# EAGLE design reader (EAGLE 6.4)
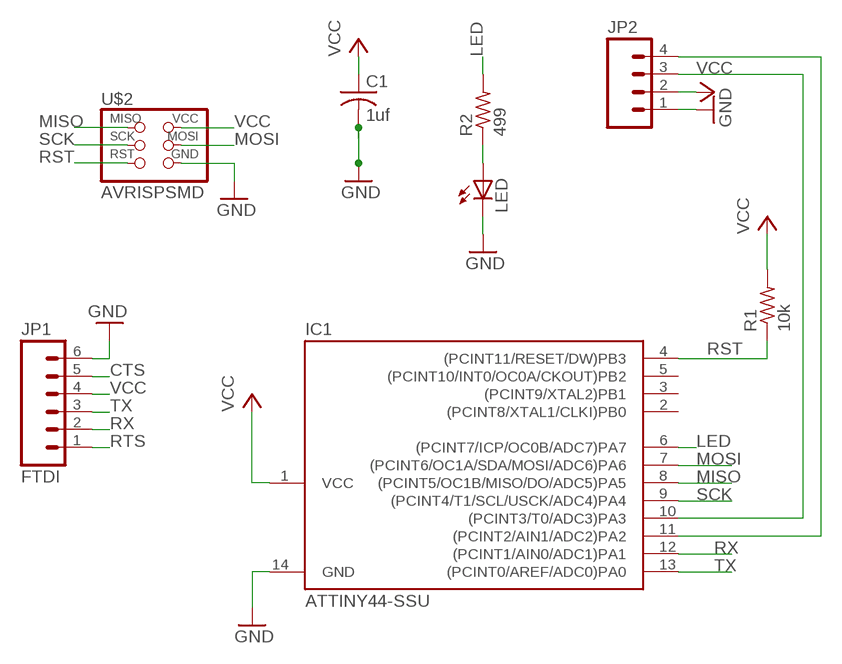
[diagram p0: schematic, sheet 1]

## Parts
C1  1uf  C-USC1206  [C1206]
IC1  ATTINY44-SSU  [SOIC14]
JP1  FTDI  M06SMD  [1X06-SMD]
JP2  M04LONGPADS  [1X04_LONGPADS]
LED  LEDSMT1206  [1206]
R1  10k  R-US_R1206  [R1206]
R2  499  R-US_R1206  [R1206]
U$2  AVRISPSMD  [2X03SMD]

## Nets
CTS: JP1.5
GND: C1.2 IC1.14(GND) JP1.6 JP2.1 LED.C U$2.6(GND)
LED: IC1.6((PCINT7/ICP/OC0B/ADC7)PA7) R2.2
MISO: IC1.8((PCINT5/OC1B/MISO/DO/ADC5)PA5) U$2.1(MISO)
MOSI: IC1.7((PCINT6/OC1A/SDA/MOSI/ADC6)PA6) U$2.4(MOSI)
N$1: IC1.10((PCINT3/T0/ADC3)PA3) JP2.3
N$2: IC1.11((PCINT2/AIN1/ADC2)PA2) JP2.4
N$4: LED.A R2.1
RST: IC1.4((PCINT11/RESET/DW)PB3) R1.1 U$2.5(RST)
RTS: JP1.1
RX: IC1.12((PCINT1/AIN0/ADC1)PA1) JP1.2
SCK: IC1.9((PCINT4/T1/SCL/USCK/ADC4)PA4) U$2.3(SCK)
TX: IC1.13((PCINT0/AREF/ADC0)PA0) JP1.3
VCC: C1.1 IC1.1(VCC) JP1.4 JP2.2 R1.2 U$2.2(VCC)
Unconnected: IC1.2((PCINT8/XTAL1/CLKI)PB0) IC1.3((PCINT9/XTAL2)PB1) IC1.5((PCINT10/INT0/OC0A/CKOUT)PB2)

## Library data of the parts
C1 = rcl:C-US: CAPACITOR, American symbol
IC1 = fab:ATTINY44
JP1 = SparkFun:M06: Header 6 Standard 6-pin 0.1" header. Use with straight break away headers (SKU : PRT-00116), right angle break away headers (PRT-00553), swiss pins (PRT-00743), machine pins (PRT-00117), and female headers (PRT-00115). Molex polarized connector foot print use with SKU : PRT-08094 with associated crimp pins and housings. NOTES ON THE VARIANTS LOCK and LOCK_LONGPADS... This footprint was designed to help hold the alignment of a through-hole component (i.e. 6-pin header) while soldering it into place. You may notice that each hole has been shifted either up or down by 0.005 of an inch from it's more standard position (which is a perfectly straight line). This slight alteration caused the pins (the squares in the middle) to touch the edges of the holes. Because they are alternating, it causes a "brace" to hold the component in place. 0.005 has proven to be the perfect amount of "off-center" position when using our standard breakaway headers. Although looks a little odd when you look at the bare footprint, once you have a header in there, the alteration is very hard to notice. Also, if you push a header all the way into place, it is covered up entirely on the bottom side. This idea of altering the position of holes to aid alignment will be further integrated into the Sparkfun Library for other footprints. It can help hold any component with 3 or more connection pins.
JP2 = 01_SparkFun:M04: Header 4 Standard 4-pin 0.1" header. Use with straight break away headers (SKU : PRT-00116), right angle break away headers (PRT-00553), swiss pins (PRT-00743), machine pins (PRT-00117), and female headers (PRT-00115). Molex polarized connector foot print use with SKU : PRT-08231 with associated crimp pins and housings.
LED = 01_adafruit:LED: LED OSRAM: - CHIPLED LG R971, LG N971, LY N971, LG Q971, LY Q971, LO R971, LY R971 LH N974, LH R974 LS Q976, LO Q976, LY Q976 LO Q996 - Hyper CHIPLED LW Q18S LB Q993, LB Q99A, LB R99A - SideLED LS A670, LO A670, LY A670, LG A670, LP A670 LB A673, LV A673, LT A673, LW A673 LH A674 LY A675 LS A676, LA A676, LO A676, LY A676, LW A676 LS A679, LY A679, LG A679 - Hyper Micro SIDELED® LS Y876, LA Y876, LO Y876, LY Y876 LT Y87S - SmartLED LW L88C, LW L88S LB L89C, LB L89S, LG L890 LS L89K, LO L89K, LY L89K LS L896, LA L896, LO L896, LY L896 - TOPLED LS T670, LO T670, LY T670, LG T670, LP T670 LSG T670, LSP T670, LSY T670, LOP T670, LYG T670 LG T671, LOG T671, LSG T671 LB T673, LV T673, LT T673, LW T673 LH T674 LS T676, LA T676, LO T676, LY T676, LB T676, LH T676, LSB T676, LW T676 LB T67C, LV T67C, LT T67C, LS T67K, LO T67K, LY T67K, LW E67C LS E67B, LA E67B, LO E67B, LY E67B, LB E67C, LV E67C, LT E67C LW T67C LS T679, LY T679, LG T679 LS T770, LO T770, LY T770, LG T770, LP T770 LB T773, LV T773, LT T773, LW T773 LH T774 LS E675, LA E675, LY E675, LS T675 LS T776, LA T776, LO T776, LY T776, LB T776 LHGB T686 LT T68C, LB T68C - Hyper Mini TOPLED® LB M676 - Mini TOPLED Santana® LG M470 LS M47K, LO M47K, LY M47K Source: http://www.osram.convergy.de/
R1 R2 = resistor:R-US_: RESISTOR, American symbol
U$2 = fab:AVRISP

## Board
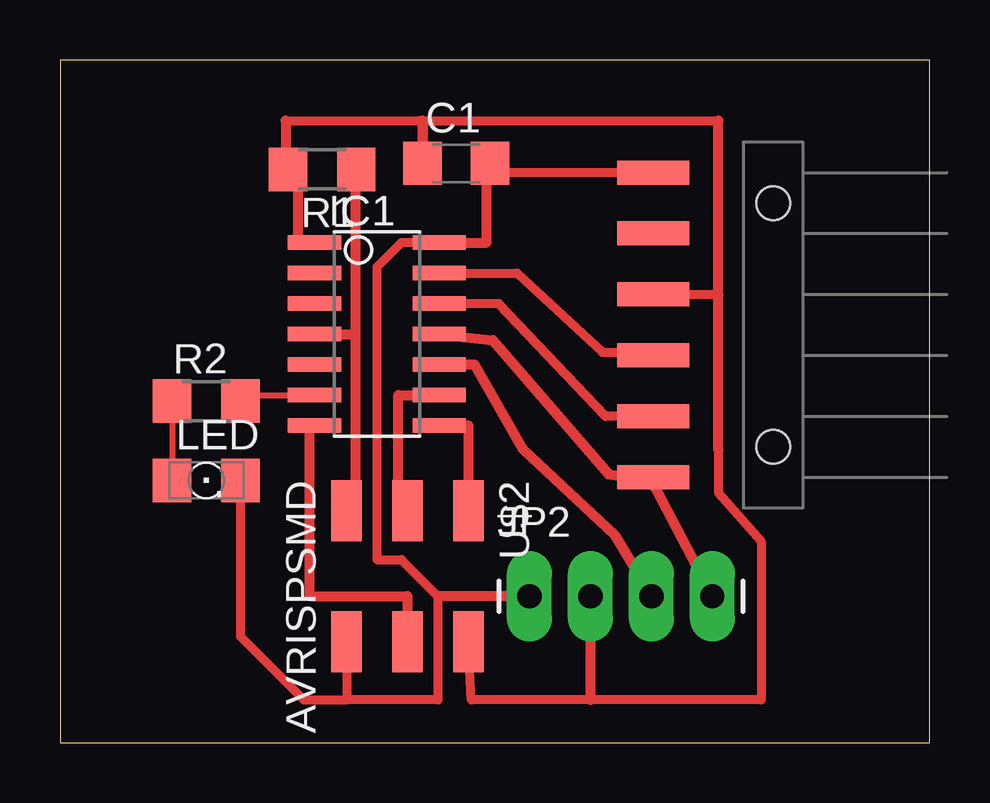
[diagram p1: board, top side]

Size 36.25 x 28.44 mm. Coordinates in mm from the lower left corner, seen from the top.
Outline: 0,0 36.25,0 36.25,28.44 0,28.44 0,0
Copper layers 1: Top 0.035mm
Design rules "ERP-1sided-10mil-16mill": minimum track width 10mil, minimum drill 24mil, track to track 16mil, track to pad 16mil, pad to pad 16mil, via to via 16mil, smd to smd 0mil, copper to edge 16mil, drill to drill 36mil, minimum pad ring 10mil, minimum via ring 8mil, stop-mask expansion 4mil, vias tented up to drill 0mil, thermal gap 10mil

### Footprints (pad centres in the part's own frame; a part is rotated, then mirrored left to right if it is on the bottom)
C1206 = smd 1.6 x 1.8: 1 -1.4,0; 2 1.4,0
SOIC14 = smd 0.61 x 2.21: 1 -3.81,-2.603; 2 -2.54,-2.603; 3 -1.27,-2.603; 4 0,-2.603; 5 1.27,-2.603; 6 2.54,-2.603; 7 3.81,-2.603; 8 3.81,2.603; 9 2.54,2.603; 10 1.27,2.603; 11 0,2.603; 12 -1.27,2.603; 13 -2.54,2.603; 14 -3.81,2.603
1X06-SMD = smd 1 x 3: 1 -6.35,5; 2 -3.81,5; 3 -1.27,5; 4 1.27,5; 5 3.81,5; 6 6.35,5 | hole 1.4: -5.08,0; 5.08,0
1X04_LONGPADS = drill 1.016 pad 1.88 long: 1 0,0; 2 2.54,0; 3 5.08,0; 4 7.62,0
1206 = smd 1.6 x 1.803: A -1.422,0; C 1.422,0
R1206 = smd 1.6 x 1.803: 1 -1.422,0; 2 1.422,0
2X03SMD = smd 2.54 x 1.27: 1 -2.54,2.54; 2 2.92,2.54; 3 -2.54,0; 4 2.92,0; 5 -2.54,-2.54; 6 2.92,-2.54

### Placement (x,y rotation side)
C1  16.51,24.13 0 top
IC1  13.21,17.02 270 top
JP1  29.72,17.4 90 top
JP2  19.56,6.1 0 top
LED  6.1,10.92 0 top
R1  10.92,23.88 180 top
R2  6.1,14.22 0 top
U$2  14.48,7.11 270 top

### Tracks (layer width: path | path; a pad name or v marks a point on that pad's centre or on a via)
GND
  Top 0.254: 11.94,3.81 U$2.6 11.68,4.06
  Top 0.381: 11.94,3.81 11.94,1.78 | 11.94,1.78 15.75,1.78 15.75,6.1 14.22,7.62 13.21,7.62 13.21,19.81 14.22,20.83 IC1.14 | LED.C 7.52,4.42 10.16,1.78 11.94,1.78 | C1.2 17.91,24.26 18.03,24.38 | JP1.6 17.91,23.75
  Top 0.406: JP1.6 24.97,24 | IC1.14 17.78,20.83 17.78,23.88 C1.2 17.91,23.75 | JP2.1 15.75,6.1
LED
  Top 0.254: R2.2 7.81,14.48 IC1.6
MISO
  Top 0.406: IC1.8 17.02,13.21 U$2.1
MOSI
  Top 0.406: IC1.7 10.41,13.21 10.41,6.1 14.48,6.1 U$2.4
N$1
  Top 0.406: IC1.10 17.27,15.75 19.3,12.19 23.11,8.64 JP2.3
N$2
  Top 0.406: IC1.11 18.03,16.76 22.86,11.18 24.64,10.92 JP2.4
N$4
  Top 0.254: R2.1 LED.A
RST
  Top 0.406: R1.1 12.32,23.88 12.32,17.02 | IC1.4 12.32,17.02 | U$2.5 12.32,9.4 12.32,17.02
RX
  Top 0.381: JP1.2 22.73,13.59 18.29,18.29 IC1.12
SCK
  Top 0.406: U$2.3 14.1,9.4 14.1,14.48 IC1.9
TX
  Top 0.381: IC1.13 19.05,19.56 22.61,16.26 24.59,16.26 JP1.3
VCC
  Top 0.381: 27.43,12.19 27.43,10.41 29.21,8.38 29.21,1.78 22.1,1.78 17.14,1.78 U$2.2 | JP1.4 27.43,18.67 | 9.4,25.91 14.99,25.91 | 14.99,25.91 15.11,25.91 27.43,25.91 | 15.11,23.88 15.11,25.78 14.99,25.91
  Top 0.406: 15.11,25.91 C1.1 15.11,23.88 15.11,25.91 | 9.4,25.91 9.4,23.88 R1.2 9.91,23.88 9.91,20.83 IC1.1 | 27.43,12.19 27.43,18.67 27.43,25.91 | JP2.2 22.1,1.78